# Altium schematic sheet TimerSwitch.SchDoc
size A4
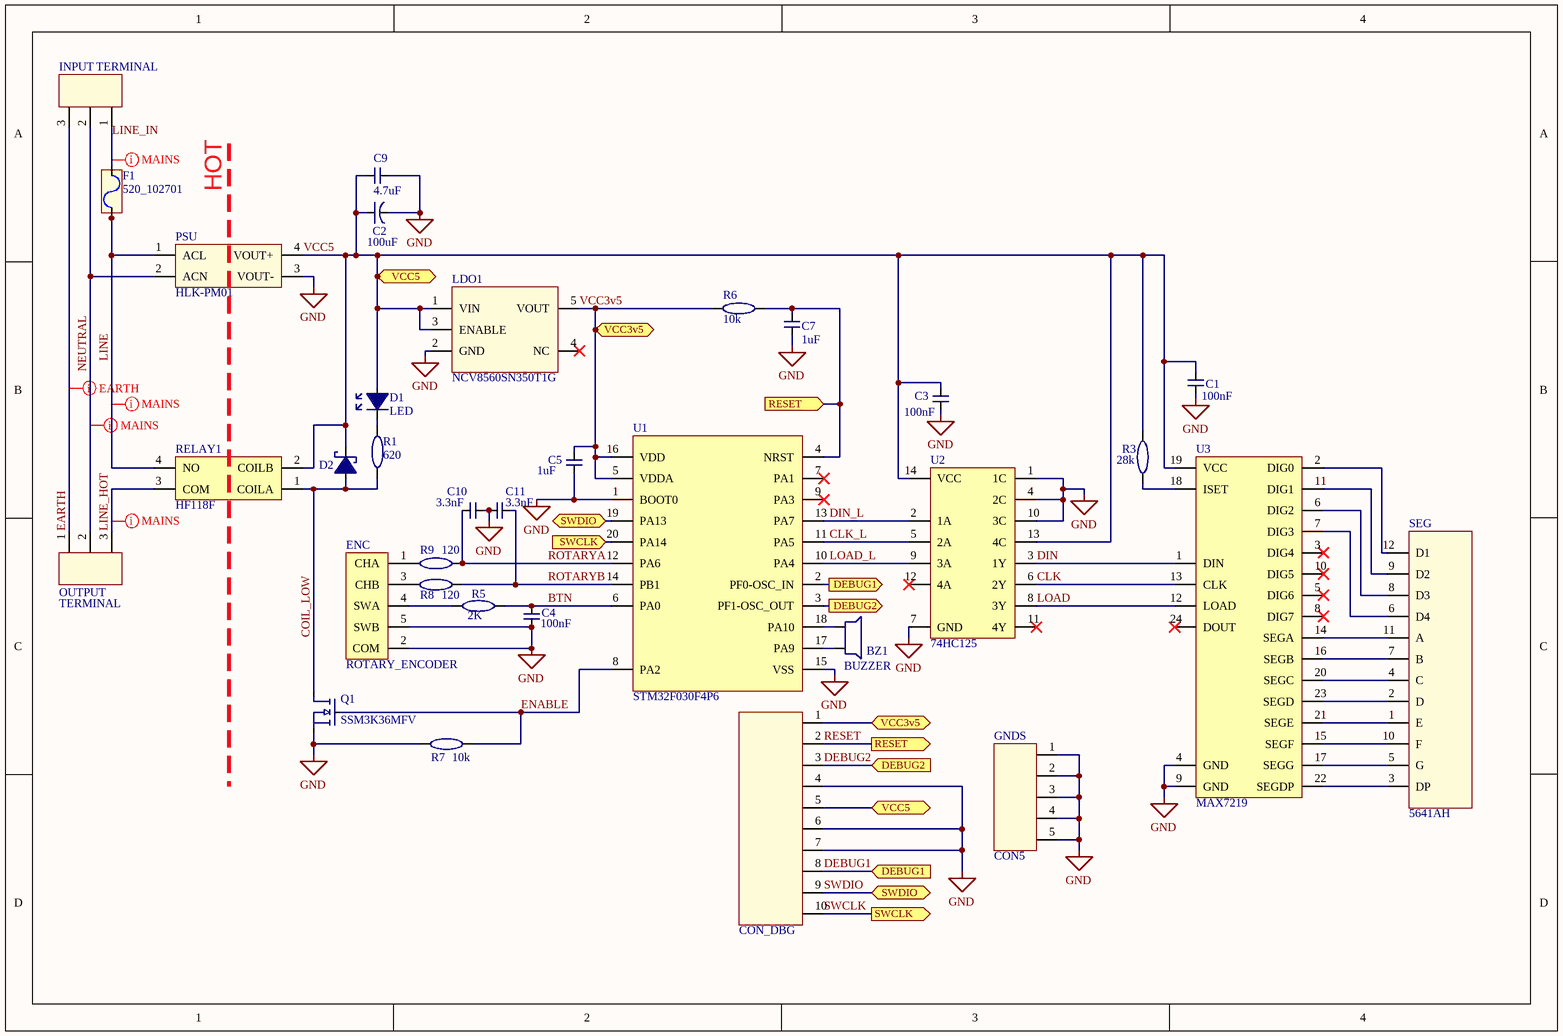
[diagram p0: TimerSwitch.SchDoc]

## Parts
BZ1  BUZZER  [PIEZO_BUZZER]
C1  100nF  [CAPC1608X07L]
C2  100uF  [CAPAE9585X105L]
C3  100nF  [CAPC1608X07L]
C4  100nF  [CAPC1608X07L]
C5  1uF  [CAPC1608X07L]
C7  1uF  [CAPC1608X07L]
C9  4.7uF  [CAPC3216X07L]
C10  3.3nF  [CAPC1608X07L]
C11  3.3nF  [CAPC1608X07L]
CON_DBG  CON10  [CON10]  (value not drawn)  (no BOM)
D1  LED  [LED]
D2  DSF05S30U  [SODFL250X100-2L]  (value not drawn)
ENC  ROTARY_ENCODER  [PEC12R-4XXXF-SXXXX_1]
F1  520_102701  [5x20 FUSE]
GNDS  CON5  [CON5]  (no BOM)
INPUT  TERMINAL  [TERMINAL_BLOCK]
LDO1  NCV8560SN350T1G  [TSOP95P280X110-6L]
OUTPUT  TERMINAL  [TERMINAL_BLOCK]
PSU  HLK-PM01  [HLK-PM01]
Q1  SSM3K36MFV  [SOT95P230X110-3L]
R1  620  [RESC1608X05L]
R3  28k  [RESC1608X05L]
R5  2K  [RESC1608X05L]
R6  10k  [RESC1608X05L]
R7  10k  [RESC1608X05L]
R8  120  [RESC1608X05L]
R9  120  [RESC1608X05L]
RELAY1  HF118F  [G5RL-1-E-HR]
SEG  5641AH  [5641AH]
U1  STM32F030F4P6  [TSOP65P630X120-20L]
U2  74HC125  [SOIC127P600X175-14L]
U3  MAX7219  [SOIC127P1030X265-24L]

## Ports
DEBUG1 (in), DEBUG1 (out), DEBUG2 (in), DEBUG2 (out), RESET (in), RESET (out), SWCLK (in), SWCLK (out), SWDIO (bidir), VCC3v5 (bidir), VCC5 (bidir)

## Nets
GND: C1.1(A) C2.2(C) C3.1(A) C4.1(A) C5.2(B) C7.1(A) C9.2(B) C10.2(B) C11.1(A) CON_DBG.4 CON_DBG.6 CON_DBG.7 ENC.2(COM) ENC.5(SWB) GNDS.1 GNDS.2 GNDS.3 GNDS.4 GNDS.5 LDO1.2(GND) PSU.3(VOUT-) Q1.2(S) R7.1(A) U1.1(BOOT0) U1.15(VSS) U2.1(1C) U2.4(2C) U2.7(GND) U2.10(3C) U3.4(GND) U3.9(GND)
BTN: C4.2(B) R5.1(A) U1.6(PA0)
CLK: U2.6(2Y) U3.13(CLK)
CLK_L: U1.11(PA5) U2.5(2A)
COIL_LOW: D2.1(A) Q1.3(D) R1.1(A) RELAY1.1(COILA)
DEBUG1: CON_DBG.8 U1.2(PF0-OSC_IN) ; port DEBUG1
DEBUG2: CON_DBG.3 U1.3(PF1-OSC_OUT) ; port DEBUG2
DIN: U2.3(1Y) U3.1(DIN)
DIN_L: U1.13(PA7) U2.2(1A)
EARTH: INPUT.3 OUTPUT.1
ENABLE: Q1.1(G) R7.2(B) U1.8(PA2)
LINE: F1.2 PSU.1(ACL) RELAY1.4(NO)
LINE_HOT: OUTPUT.3 RELAY1.3(COM)
LINE_IN: F1.1 INPUT.1
LOAD: U2.8(3Y) U3.12(LOAD)
LOAD_L: U1.10(PA4) U2.9(3A)
NEUTRAL: INPUT.2 OUTPUT.2 PSU.2(ACN)
RESET: C7.2(B) CON_DBG.2 R6.1(A) U1.4(NRST) ; port RESET
ROTARYA: C10.1(A) R9.2(B) U1.12(PA6)
ROTARYB: C11.2(B) R8.2(B) U1.14(PB1)
SWCLK: CON_DBG.10 U1.20(PA14) ; port SWCLK
SWDIO: CON_DBG.9 U1.19(PA13) ; port SWDIO
VCC3v5: C5.1(A) CON_DBG.1 LDO1.5(VOUT) R6.2(B) U1.5(VDDA) U1.16(VDD) ; port VCC3v5
VCC5: C1.2(B) C2.1(A) C3.2(B) C9.1(A) CON_DBG.5 D1.1(A) D2.2(C) LDO1.1(VIN) LDO1.3(ENABLE) PSU.4(VOUT+) R3.2(B) RELAY1.2(COILB) U2.13(4C) U2.14(VCC) U3.19(VCC) ; port VCC5
NetBZ1_1: BZ1.1 U1.18(PA10)
NetBZ1_2: BZ1.2 U1.17(PA9)
NetD1_2: D1.2(C) R1.2(B)
NetENC_1: ENC.1(CHA) R9.1(A)
NetENC_3: ENC.3(CHB) R8.1(A)
NetENC_4: ENC.4(SWA) R5.2(B)
NetR3_1: R3.1(A) U3.18(ISET)
NetSEG_1: SEG.1(E) U3.21(SEGE)
NetSEG_2: SEG.2(D) U3.23(SEGD)
NetSEG_3: SEG.3(DP) U3.22(SEGDP)
NetSEG_4: SEG.4(C) U3.20(SEGC)
NetSEG_5: SEG.5(G) U3.17(SEGG)
NetSEG_6: SEG.6(D4) U3.7(DIG3)
NetSEG_7: SEG.7(B) U3.16(SEGB)
NetSEG_8: SEG.8(D3) U3.6(DIG2)
NetSEG_9: SEG.9(D2) U3.11(DIG1)
NetSEG_10: SEG.10(F) U3.15(SEGF)
NetSEG_11: SEG.11(A) U3.14(SEGA)
NetSEG_12: SEG.12(D1) U3.2(DIG0)

Not connected (* = marked no-connect by the designer): LDO1 4(NC)*; U1 7(PA1)* 9(PA3)*; U2 11(4Y)* 12(4A)*; U3 3(DIG4)* 5(DIG6)* 8(DIG7)* 10(DIG5)* 24(DOUT)*

## Layout directives
net class MAINS: LINE, LINE_HOT, LINE_IN, NEUTRAL
net class EARTH: EARTH

## Notes on the sheet
- HOT

## Library data of the parts
C1 C3-C5 C7 = CAP_CERAMIC
  C1 C3 C4: Value: 100nF
  C5 C7: Value: 1uF
C2 = CAP_ELECTROLYTIC: Value: 100uF
C9-C11 = CAP_CERAMIC: Ceramic capacitor
  C9: Value: 4.7uF
  C10 C11: Value: 3.3nF
CON_DBG = CON10: Debug connector
D1 = LED: 5mm through hole LED
D2 = DSF05S30U: Schottky Diode 20v 500mA; Alternate: CUS551V30
ENC = ROTARY_ENCODER: Generic rotary encoder
F1 = 520_102701: 5x20 5A fuse speed F
INPUT OUTPUT = TERMINAL: 3 way terminal block
LDO1 = NCV8560SN350T1G: 3.5V 150mA LDO
PSU = HLK-PM01: 5V PSU 0.6A
Q1 = SSM3K36MFV: MOSFET N
R1 R3 R5-R7 = RESISTOR
  R1: Value: 620
  R3: Value: 28k
  R5: Value: 2K
  R6 R7: Value: 10k
R8 R9 = RESISTOR: Resistor 1%; Value: 120
RELAY1 = HF118F: 240V 10A Relay 5V
SEG = 5641AH: 7+1 x 4 Segment display
U1 = STM32F030F4P6: Microcontroller 4KB RAM 16KB Flash
U2 = 74HC125: 4 Channel level shifter
U3 = MAX7219: 7 Segment LED Driver